# EAGLE design wt12_uart_breakout_board_v21 (EAGLE 6.5.0)
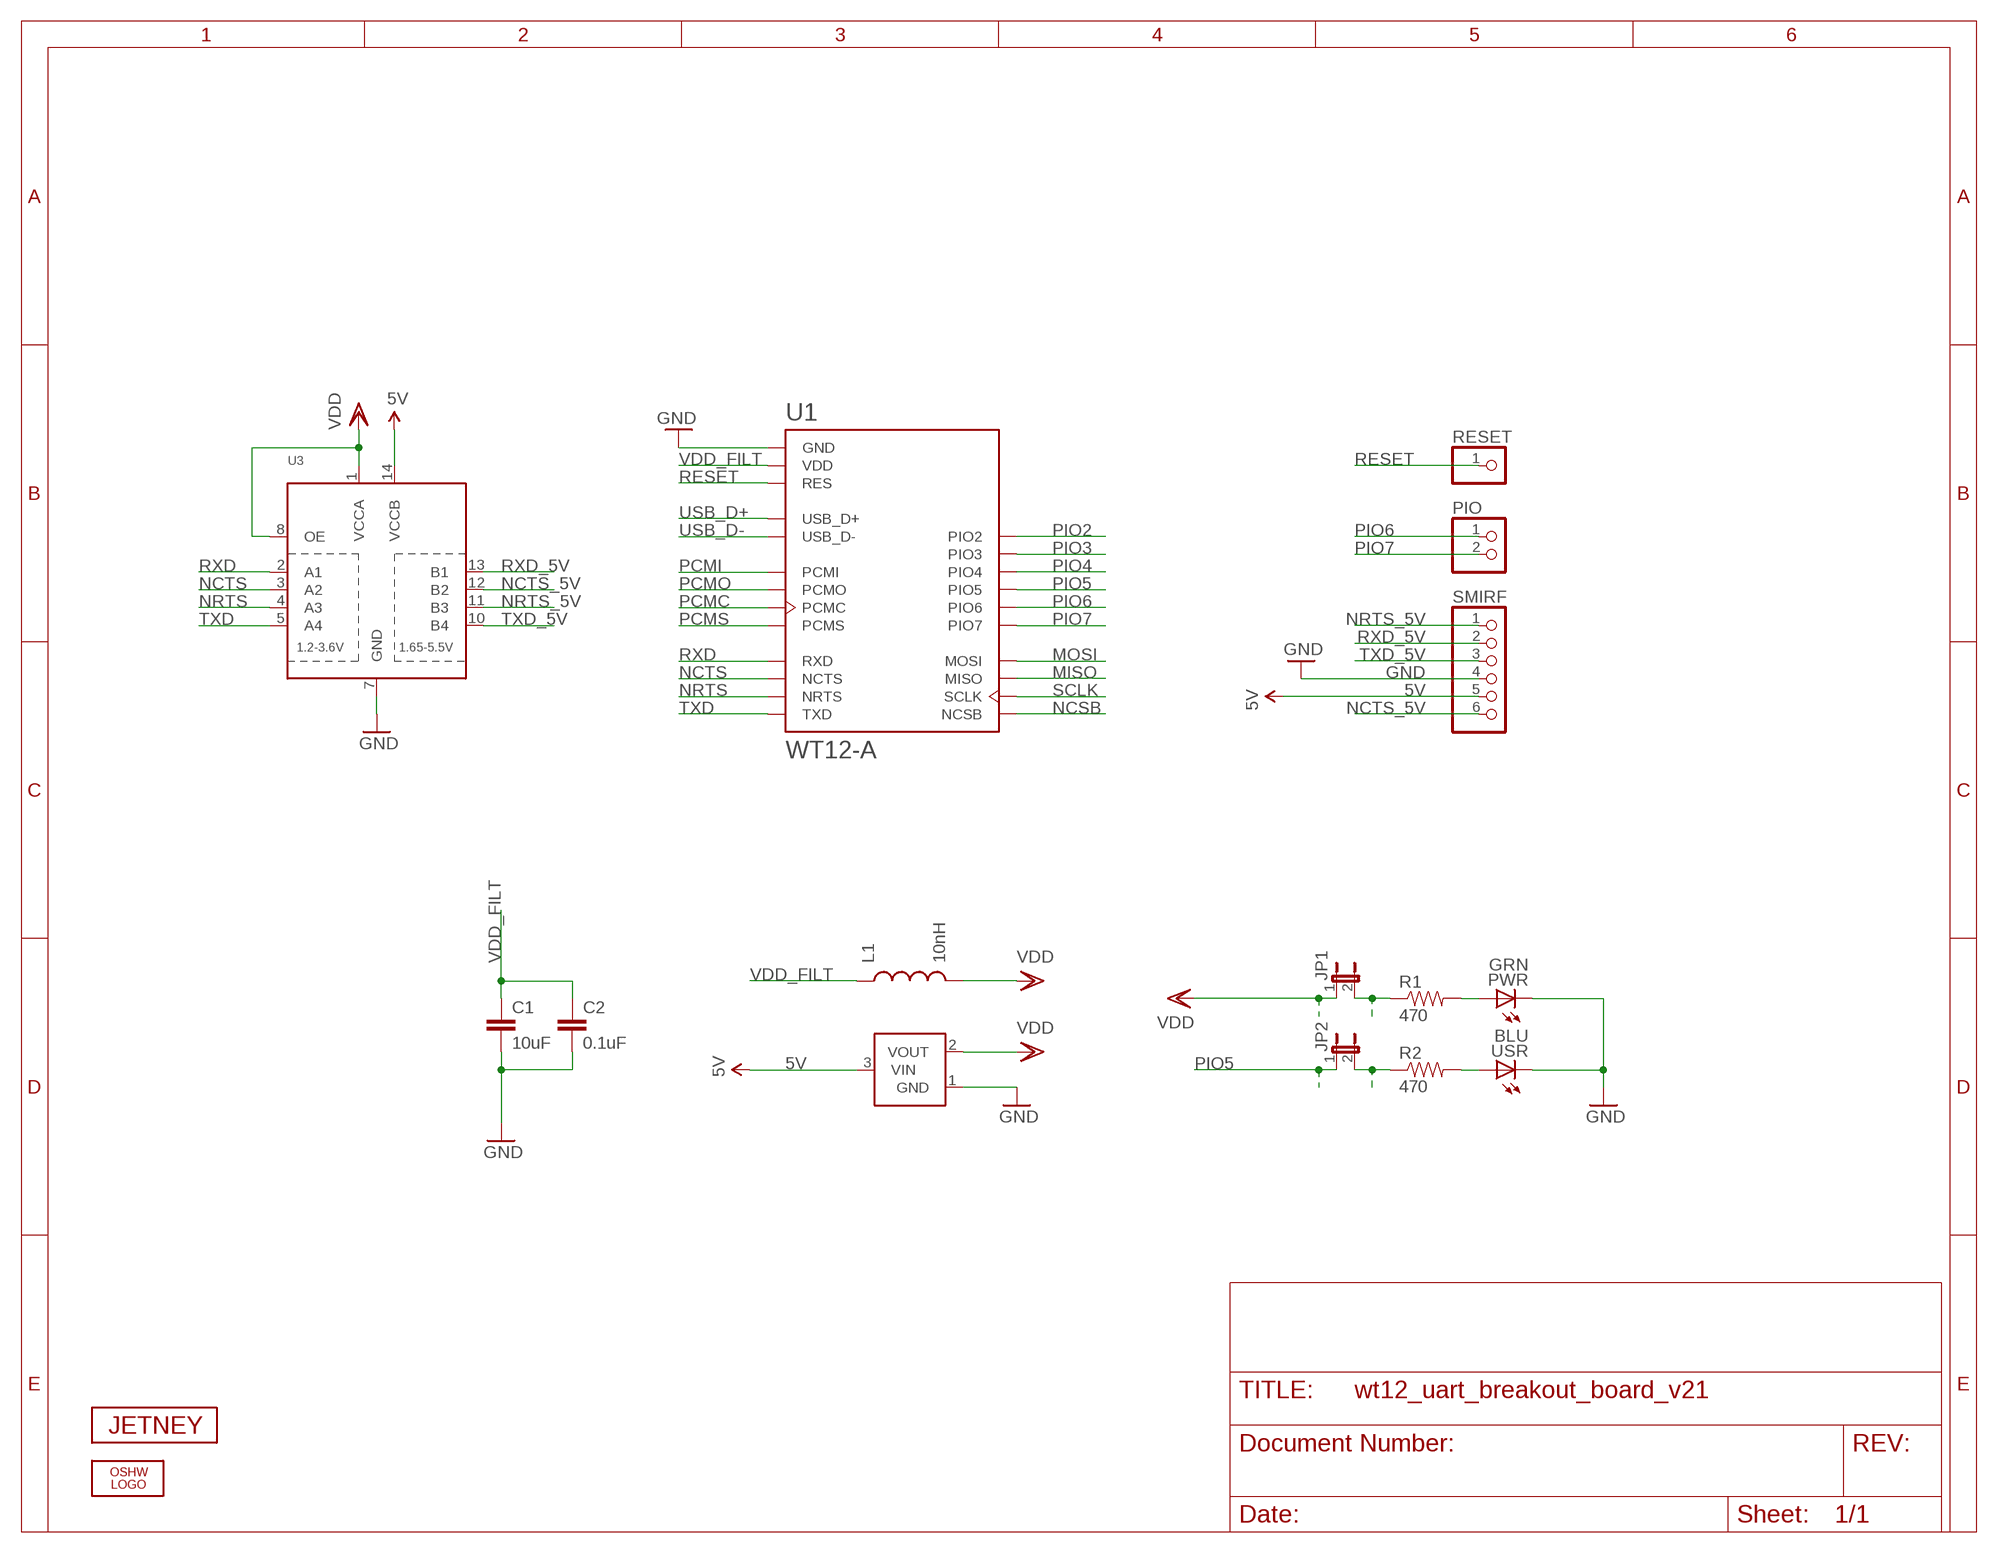
[diagram p0: schematic, sheet 1]

## Parts
C1  10uF  CAP0603-CAP  [0603-CAP]
C2  0.1uF  CAP0603-CAP  [0603-CAP]
JP1  JUMPER-2SMD-NC  [SJ_2S]
JP2  JUMPER-2SMD-NC  [SJ_2S]
L1  10nH  INDUCTOR0603  [0603]
LOGO1  OSHW_LOGO_FILLX0070-NT  [OSHW_FILLX70_NOTEXT]
PIO  PINHD-1X2  [1X02]
PWR  GRN  LEDCHIPLED_0805  [CHIPLED_0805]
R1  470  RESISTOR0603-RES  [0603-RES]
R2  470  RESISTOR0603-RES  [0603-RES]
RESET  PINHD-1X1  [1X01]
SMIRF  PINHD-1X6  [1X06]
U1  WT12-A  [WT12-A]
U2  MCP1700  [SOT23-3]
U3  TXB0104PWR  [TSSOP14]
U$4  JETNEY-LOGO-12  [JETNEY-LOGO-12]
USR  BLU  LEDCHIPLED_0805  [CHIPLED_0805]

## Nets
5V [power]: SMIRF.5 U2.3(VIN) U3.14(VCCB)
GND [power]: C1.2 C2.2 PWR.C SMIRF.4 U1.GND U1.GND@2(GND) U1.GND@3(GND) U1.GND@4(GND) U2.1(GND) U3.7(GND) USR.C
MISO: U1.MISO
MOSI: U1.MOSI
N$1: PWR.A R1.2
N$3: R2.2 USR.A
N$4: JP2.2 R2.1
NCSB: U1.NCSB
NCTS: U1.NCTS U3.3(A2)
NCTS_5V: SMIRF.6 U3.12(B2)
NRTS: U1.NRTS U3.4(A3)
NRTS_5V: SMIRF.1 U3.11(B3)
PCMC: U1.PCMC
PCMI: U1.PCMI
PCMO: U1.PCMO
PCMS: U1.PCMS
PIO2: U1.PIO2
PIO3: U1.PIO3
PIO4: U1.PIO4
PIO5: JP2.1 U1.PIO5
PIO6: PIO.1 U1.PIO6
PIO7: PIO.2 U1.PIO7
RESET: RESET.1 U1.RES
RXD: U1.RXD U3.2(A1)
RXD_5V: SMIRF.2 U3.13(B1)
SCLK: U1.SCLK
TXD: U1.TXD U3.5(A4)
TXD_5V: SMIRF.3 U3.10(B4)
USB_D+: U1.USB_D+
USB_D-: U1.USB_D-
VDD [power]: JP1.1 L1.2 U2.2(VOUT) U3.1(VCCA) U3.8(OE)
VDD_FILT [power]: C1.1 C2.1 L1.1 U1.VDD U1.VDD@2(VDD)
VDDJP1 [power]: JP1.2 R1.1

## Library data of the parts
C1 C2 = SparkFun:CAP: Capacitor Standard 0603 ceramic capacitor, and 0.1" leaded capacitor.
JP1 JP2 = SparkFun:JUMPER-2: Jumper Basic 0.1" spaced jumper. Use with breakaway headers.
L1 = SparkFun:INDUCTOR: Inductors Basic Inductor/Choke - 0603 and 1206. Footprints are not proven and vary greatly between part numbers.
LOGO1 = oshw-logo:OSHW_LOGO_FILL
PIO = sf-pinhead:PINHD-1X2: PIN HEADER
PWR USR = adafruit:LED: LED OSRAM: - CHIPLED LG R971, LG N971, LY N971, LG Q971, LY Q971, LO R971, LY R971 LH N974, LH R974 LS Q976, LO Q976, LY Q976 LO Q996 - Hyper CHIPLED LW Q18S LB Q993, LB Q99A, LB R99A - SideLED LS A670, LO A670, LY A670, LG A670, LP A670 LB A673, LV A673, LT A673, LW A673 LH A674 LY A675 LS A676, LA A676, LO A676, LY A676, LW A676 LS A679, LY A679, LG A679 - Hyper Micro SIDELED® LS Y876, LA Y876, LO Y876, LY Y876 LT Y87S - SmartLED LW L88C, LW L88S LB L89C, LB L89S, LG L890 LS L89K, LO L89K, LY L89K LS L896, LA L896, LO L896, LY L896 - TOPLED LS T670, LO T670, LY T670, LG T670, LP T670 LSG T670, LSP T670, LSY T670, LOP T670, LYG T670 LG T671, LOG T671, LSG T671 LB T673, LV T673, LT T673, LW T673 LH T674 LS T676, LA T676, LO T676, LY T676, LB T676, LH T676, LSB T676, LW T676 LB T67C, LV T67C, LT T67C, LS T67K, LO T67K, LY T67K, LW E67C LS E67B, LA E67B, LO E67B, LY E67B, LB E67C, LV E67C, LT E67C LW T67C LS T679, LY T679, LG T679 LS T770, LO T770, LY T770, LG T770, LP T770 LB T773, LV T773, LT T773, LW T773 LH T774 LS E675, LA E675, LY E675, LS T675 LS T776, LA T776, LO T776, LY T776, LB T776 LHGB T686 LT T68C, LB T68C - Hyper Mini TOPLED® LB M676 - Mini TOPLED Santana® LG M470 LS M47K, LO M47K, LY M47K Source: http://www.osram.convergy.de/
R1 R2 = SparkFun:RESISTOR: Resistor Basic schematic elements and footprints for 0603, 1206, and PTH resistors.
RESET = sf-pinhead:PINHD-1X1: PIN HEADER
SMIRF = sf-pinhead:PINHD-1X6: PIN HEADER
U1 = sf-bluegiga:WT12: Bluegiga WT12 class 2 Bluetooth 2.1 + EDR module. WT12-A variant has an on-module ceramic chip antenna. WT12-A variant includes keepout/restrict area. Antenna edge of the module should be flush up against the edge of the PCB. See datasheet for variant layout details. The WT12 is a fully integrated Bluetooth 2.1 + EDR, class 2 module combining antenna, Bluetooth radio, and an on-board iWRAP Bluetooth stack. Bluegiga's WT12 constitutes the ideal solution for developers that want to quickly integrate Bluetooth wireless technology into their design without investing several months in Bluetooth radio and stack development. It uses Bluegiga's iWRAP Bluetooth stack, which is an embedded Bluetooth stack implementing 13 different Bluetooth profiles and Apple iAP connectivity. The WT12 combined with iWRAP Bluetooth stack and Bluegiga's excellent technical support designers ensure quick time-to-market and low development costs and risks. http://www.bluegiga.com/en-US/products/bluetooth-classic-modules/wt12-bluetooth--class-2-module https://github.com/jrowberg/sf-oshw Last updated 2014-01-04 by Jeff Rowberg <jeff@rowberg.net>; ANTENNA: On-module ceramic chip antenna
U2 = nonolith:MCP1700: Voltage regulator
U3 = SparkFun-DigitalIC:TXB0104PWR: 4-Bit Bi-Directional Level Shifter 1.2V-3.6V (VCCA) to 1.65V-5.5V (VCCB) bi-directional level shifter with auto direction sensing. Max data rate - VCCA 1.8V: 20Mbps (50ns), VCCA 3.3V: 100Mbps (10ns) Digikey: 296-21929-1-ND (TSSOP) IC-11329
U$4 = sf-keyglove:JETNEY-LOGO

## Net classes
0 default: width 0.152 mm, drill 0.33 mm, clearance 0.152 mm
1 power: width 0.254 mm, drill 0.33 mm, clearance 0.152 mm

## Board
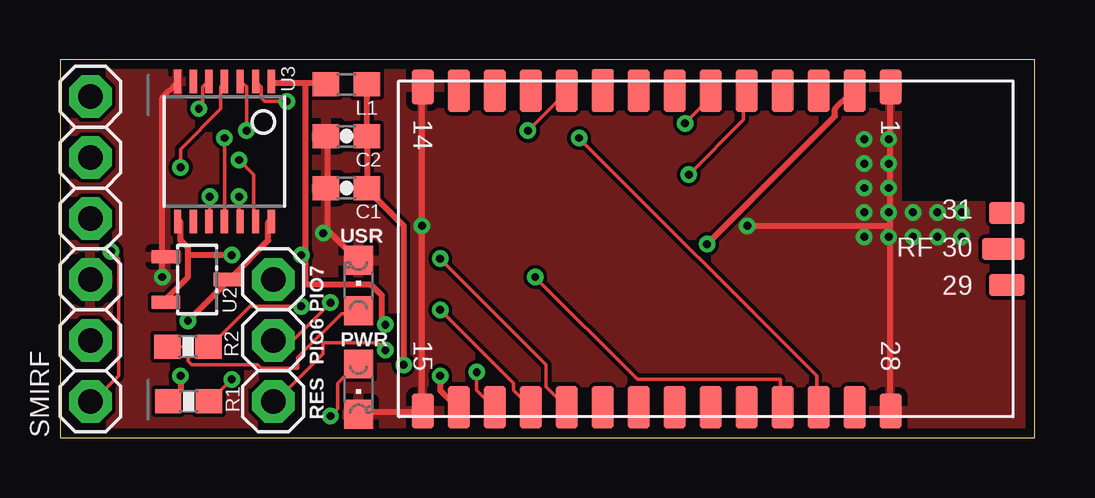
[diagram p1: board, top side]
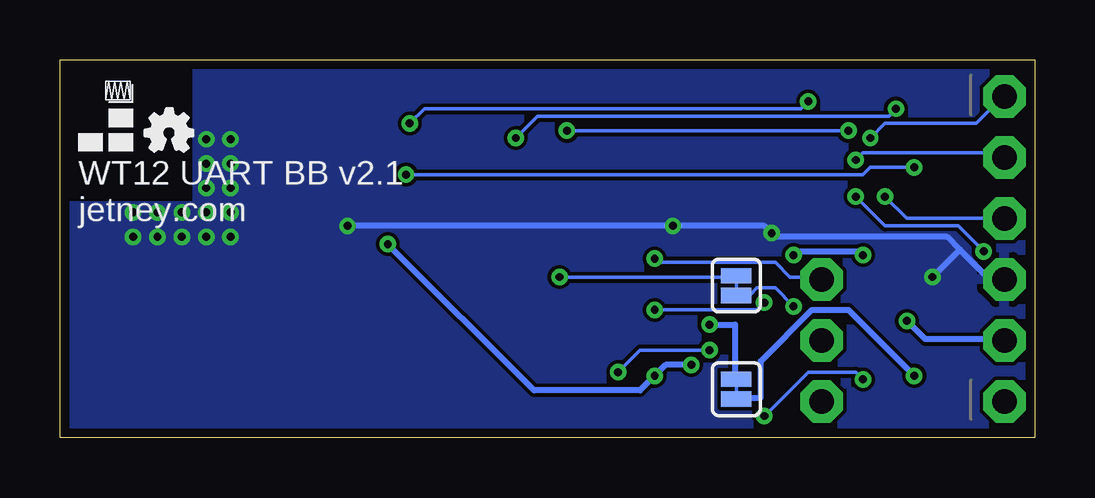
[diagram p2: board, bottom side, seen from below]

Size 40.64 x 15.75 mm. Coordinates in mm from the lower left corner, seen from the top.
Outline: 0,0 40.64,0 40.64,15.75 0,15.75 0,0
Copper layers (1*16): Top 0.0356mm / dielectric 1.5011mm / Bottom 0.0356mm
Design rules "LaenPCBOrder *": minimum track width 6mil, minimum drill 13mil, track to track 6mil, track to pad 6mil, pad to pad 6mil, via to via 6mil, smd to smd 6mil, copper to edge 15mil, drill to drill 6mil, minimum pad ring 7mil, minimum via ring 7mil, stop-mask expansion 4mil, vias tented up to drill 13mil, thermal gap 10mil
vRestrict: area 2.5,0 to 3.8,15.2; area 11.7,8.1 to 13.2,8.6; area 11.7,3.8 to 13.2,4.3; area 10.4,0.8 to 10.9,7.6

### Footprints (pad centres in the part's own frame; a part is rotated, then mirrored left to right if it is on the bottom)
0603-CAP = smd 1.1 x 1: 1 -0.85,0; 2 0.85,0
SJ_2S = smd 0.635 x 1.27: 1 -0.412,0; 2 0.412,0
0603 = smd 1.1 x 1: 1 -0.85,0; 2 0.85,0
1X02 = drill 1.016 pad 1.778 octagon: 1 -1.27,0; 2 1.27,0
CHIPLED_0805 = smd 1.2 x 1.2: A 0,-1.05; C 0,1.05
0603-RES = smd 1.1 x 1: 1 -0.85,0; 2 0.85,0
1X01 = drill 1.016 pad 1.778 octagon: 1 0,0
1X06 = drill 1.016 pad 1.778 octagon: 1 -6.35,0; 2 -3.81,0; 3 -1.27,0; 4 1.27,0; 5 3.81,0; 6 6.35,0
WT12-A = smd 1.478 x 0.914: GND -6.75,7.7; GND@2 -6.75,-11.8; GND@3 6.75,-11.8; GND@4 6.75,7.7 | smd 1.778 x 0.914: MISO 6.6,0.2; MOSI 6.6,1.7; NC 6.6,6.2; NCSB 6.6,-2.8; NCTS -6.6,-5.8; NRTS -6.6,1.7; PCMC -6.6,-8.8; PCMI -6.6,-7.3; PCMO -6.6,-1.3; PCMS -6.6,-10.3; PIO2 -6.6,4.7; PIO3 -6.6,3.2; PIO4 6.6,-4.3; PIO5 6.6,3.2; PIO6 6.6,-7.3; PIO7 6.6,-5.8; RES 6.6,-8.8; RXD -6.6,0.2; SCLK 6.6,-1.3; TXD 6.6,4.7; USB_D+ -6.6,-2.8; USB_D- -6.6,-4.3; VDD -6.6,6.2; VDD@2 6.6,-10.3 | smd 0.914 x 1.778: RF 0,12.4 | smd 0.914 x 1.478: RFGND 1.5,12.55; RFGND@2 -1.5,12.55
SOT23-3 = smd 0.55 x 1.2: 1 0.95,1.3; 2 -0.95,1.3; 3 0,-1.3
TSSOP14 = smd 0.305 x 0.991: 1 -1.95,-2.918; 2 -1.3,-2.918; 3 -0.65,-2.918; 4 0,-2.918; 5 0.65,-2.918; 6 1.3,-2.918; 7 1.95,-2.918; 8 1.95,2.918; 9 1.3,2.918; 10 0.65,2.918; 11 0,2.918; 12 -0.65,2.918; 13 -1.3,2.918; 14 -1.95,2.918

### Placement (x,y rotation side)
C1  11.94,10.41 180 top
C2  11.94,12.57 180 top
JP1  12.45,2.03 270 bottom
JP2  12.45,6.35 270 bottom
L1  11.94,14.73 180 top
LOGO1  37.08,11.94 0 bottom
PIO  8.89,5.33 90 top
PWR  12.45,2.03 180 top
R1  5.36,1.52 0 top
R2  5.33,3.81 180 top
RESET  8.89,1.52 0 top
SMIRF  1.27,7.87 270 top
U1  26.92,7.87 270 top
U2  5.71,6.6 90 top
U3  6.86,11.94 180 top
U$4  39.88,11.94 0 bottom
USR  12.45,6.35 0 top

### Tracks (layer width: path | path; a pad name or v marks a point on that pad's centre or on a via)
5V  (via drill 0.33)
  Top 0.254: U3.14 8.69,8.99 8.69,8.23 7.16,6.71 U2.3 7.01,6.55 v5.33,4.88
  Bottom 0.254: v5.33,4.88 4.57,4.12 1.37,4.12 SMIRF.5
GND  (via drill 0.33)
  Top 0.254: 14.94,1.07 12.5,1.07 PWR.C | 15.09,1.22 v15.09,8.84 15.09,14.48 | 34.59,14.48 34.59,8.84 | 34.59,8.84 34.59,1.22 | U3.7 4.88,14.78 4.27,14.17 4.27,7.62 U2.1 | 4.42,7.62 U2.1 | C2.2 11.12,12.5 11.12,10.52 C1.2 11.12,10.36 11.12,8.69 11.2,8.61 | 11.2,8.61 12.34,7.47 USR.C | v10.97,8.53 11.12,8.53 11.2,8.61 | v4.27,6.71 4.27,7.47 U2.1 | v28.65,8.84 34.59,8.84
  Bottom 0.254: 3.12,7.85 1.98,6.71 1.37,6.71 SMIRF.4 | 3.12,7.85 3.66,8.38 10.82,8.38 v10.97,8.53 11.28,8.84 v15.09,8.84 v28.65,8.84 | 3.12,7.85 v4.27,6.71
  other vias: 34.54,9.4 34.54,10.41 34.54,11.43 34.54,12.45 35.56,9.4 36.58,9.4 37.59,9.4 37.59,8.38 36.58,8.38 35.56,8.38 34.54,8.38 33.53,8.38 33.53,9.4 33.53,10.41 33.53,11.43 33.53,12.45
  pour Top: 0,15.75 40.64,15.75 40.64,0 0,0
  pour Bottom: 0,15.75 40.64,15.75 40.64,0 0,0
N$1  (via drill 0.33)
  Top 0.152: v7.16,2.44 6.25,1.52 R1.2 | v11.28,0.91 11.58,1.22 11.58,2.29 12.34,3.05 PWR.A
  Bottom 0.152: v7.16,2.44 7.47,2.74 9.45,2.74 v11.28,0.91
N$3
  Top 0.152: R2.2 5.33,3.81 5.33,3.2 5.49,3.05 8.23,3.05 8.38,2.9 9.91,2.9 9.91,3.35 11.73,5.18 12.34,5.18 USR.A
N$4  (via drill 0.33)
  Top 0.152: v10.06,5.49 7.92,5.49 6.25,3.81 R2.1
  Bottom 0.152: v10.06,5.49 10.82,6.25 11.58,6.25 11.89,5.94 12.34,5.94 JP2.2
N$5
  Bottom 0.152: 12.45,1.78 12.45,2.29
N$6
  Bottom 0.152: 12.45,6.1 12.45,6.6
NCTS  (via drill 0.33)
  Top 0.152: v7.77,12.8 7.77,14.63 7.62,14.78 U3.3 | v19.51,12.8 21.03,14.33 U1.NCTS
  Bottom 0.152: v19.51,12.8 v7.77,12.8
NCTS_5V  (via drill 0.33)
  Top 0.152: v7.47,10.06 7.47,9.14 U3.12 | v2.13,7.77 2.44,7.47 2.44,2.59 1.37,1.52 SMIRF.6
  Bottom 0.152: v7.47,10.06 6.25,8.84 3.2,8.84 v2.13,7.77
NRTS  (via drill 0.33)
  Top 0.152: v5.03,11.28 5.03,12.04 6.71,13.72 6.71,14.63 6.86,14.78 U3.4 | v26.21,10.97 28.5,13.26 28.5,14.33 U1.NRTS
  Bottom 0.152: v5.03,11.28 6.86,11.28 7.16,10.97 v26.21,10.97
NRTS_5V  (via drill 0.33)
  Top 0.152: v6.86,12.5 U3.11
  Bottom 0.152: v6.86,12.5 6.25,13.11 2.44,13.11 1.37,14.17 SMIRF.1
PIO5  (via drill 0.33)
  Top 0.152: v19.81,6.71 24.08,2.44 30.02,2.44 30.02,1.37 U1.PIO5
  Bottom 0.152: v19.81,6.71 12.5,6.71 JP2.1
PIO6  (via drill 0.33)
  Top 0.152: v15.85,5.33 18.9,2.29 18.9,1.98 19.51,1.37 U1.PIO6 | v11.28,5.64 9.75,4.12 8.99,4.12 PIO.1
  Bottom 0.152: v15.85,5.33 11.58,5.33 v11.28,5.64
PIO7  (via drill 0.33)
  Top 0.152: v15.85,7.47 20.27,3.05 20.27,2.13 21.03,1.37 U1.PIO7
  Bottom 0.152: v15.85,7.47 15.7,7.32 10.82,7.32 10.21,6.71 8.99,6.71 PIO.2
RESET  (via drill 0.33)
  Top 0.152: v17.37,2.74 17.37,1.98 17.98,1.37 U1.RES | v13.56,3.66 13.26,3.96 10.97,3.96 10.97,3.5 8.99,1.52 RESET.1
  Bottom 0.152: v17.37,2.74 16.46,3.66 v13.56,3.66
RXD  (via drill 0.33)
  Top 0.152: v9.45,14.02 8.53,14.02 8.38,14.17 8.38,14.63 8.23,14.78 U3.2 | v26.06,13.11 26.98,14.02 26.98,14.33 U1.RXD
  Bottom 0.152: v9.45,14.02 9.75,13.72 25.45,13.72 v26.06,13.11
RXD_5V  (via drill 0.33)
  Top 0.152: v7.47,11.58 8.08,10.97 8.08,9.14 U3.13
  Bottom 0.152: v7.47,11.58 7.16,11.89 1.52,11.89 1.37,11.73 SMIRF.2
TXD  (via drill 0.33)
  Top 0.152: v5.79,13.72 5.94,13.87 5.94,14.63 6.1,14.78 U3.5 | v21.64,12.5 31.55,2.59 31.55,1.37 U1.TXD
  Bottom 0.152: v5.79,13.72 6.1,13.41 20.73,13.41 v21.64,12.5
TXD_5V  (via drill 0.33)
  Top 0.152: v6.25,10.06 6.25,9.14 U3.10
  Bottom 0.152: v6.25,10.06 5.33,9.14 SMIRF.3
VDD  (via drill 0.33)
  Top 0.254: 5.33,7.62 5.33,6.71 4.42,5.79 U2.2 | 5.33,7.62 5.33,7.92 5.03,8.23 5.03,8.99 U3.8 | 10.21,14.78 10.97,14.78 L1.2 | 10.21,14.78 8.84,14.78 U3.1 | v13.56,4.72 13.41,4.88 13.41,5.94 12.95,6.4 10.21,6.4 10.21,7.62 | 10.21,14.78 10.21,7.62 | v7.16,7.62 5.33,7.62 | 10.21,7.62 v10.06,7.62
  Bottom 0.254: v13.56,4.72 12.5,4.72 12.5,2.59 JP1.1 | v7.16,7.62 7.32,7.77 9.91,7.77 v10.06,7.62
VDD_FILT  (via drill 0.33)
  Top 0.254: L1.1 12.8,14.63 12.8,12.65 C2.1 12.8,12.5 12.8,10.52 C1.1 12.8,10.36 14.33,8.84 v14.33,3.05 | v15.85,2.59 15.85,1.98 16.46,1.37 16.61,1.37 U1.VDD@2 | v26.98,8.08 32.31,13.41 32.31,13.72 32.92,14.33 33.07,14.33 U1.VDD
  Bottom 0.254: v14.33,3.05 15.39,3.05 v15.85,2.59 16.46,1.98 20.88,1.98 v26.98,8.08
VDDJP1  (via drill 0.33)
  Top 0.254: v5.03,2.59 5.03,1.98 4.57,1.52 R1.1
  Bottom 0.254: v5.03,2.59 7.77,5.33 9.3,5.33 11.43,3.2 11.43,1.68 12.34,1.68 JP1.2

### Text on the board
tPlace: PIO6 PIO7 | RES
bPlace: WT12 UART BB v2.1 | jetney.com
tDocu: RTS RXD TXD GND VCC CTS | Bluegiga / WT12-A
bDocu: RTS RXD TXD GND VCC CTS | PIO5 | PWR